# Altium schematic sheet PCA9632_4-Ch_LED_Driver.SchDoc: PCA9632 4-ch LED Driver
size A4
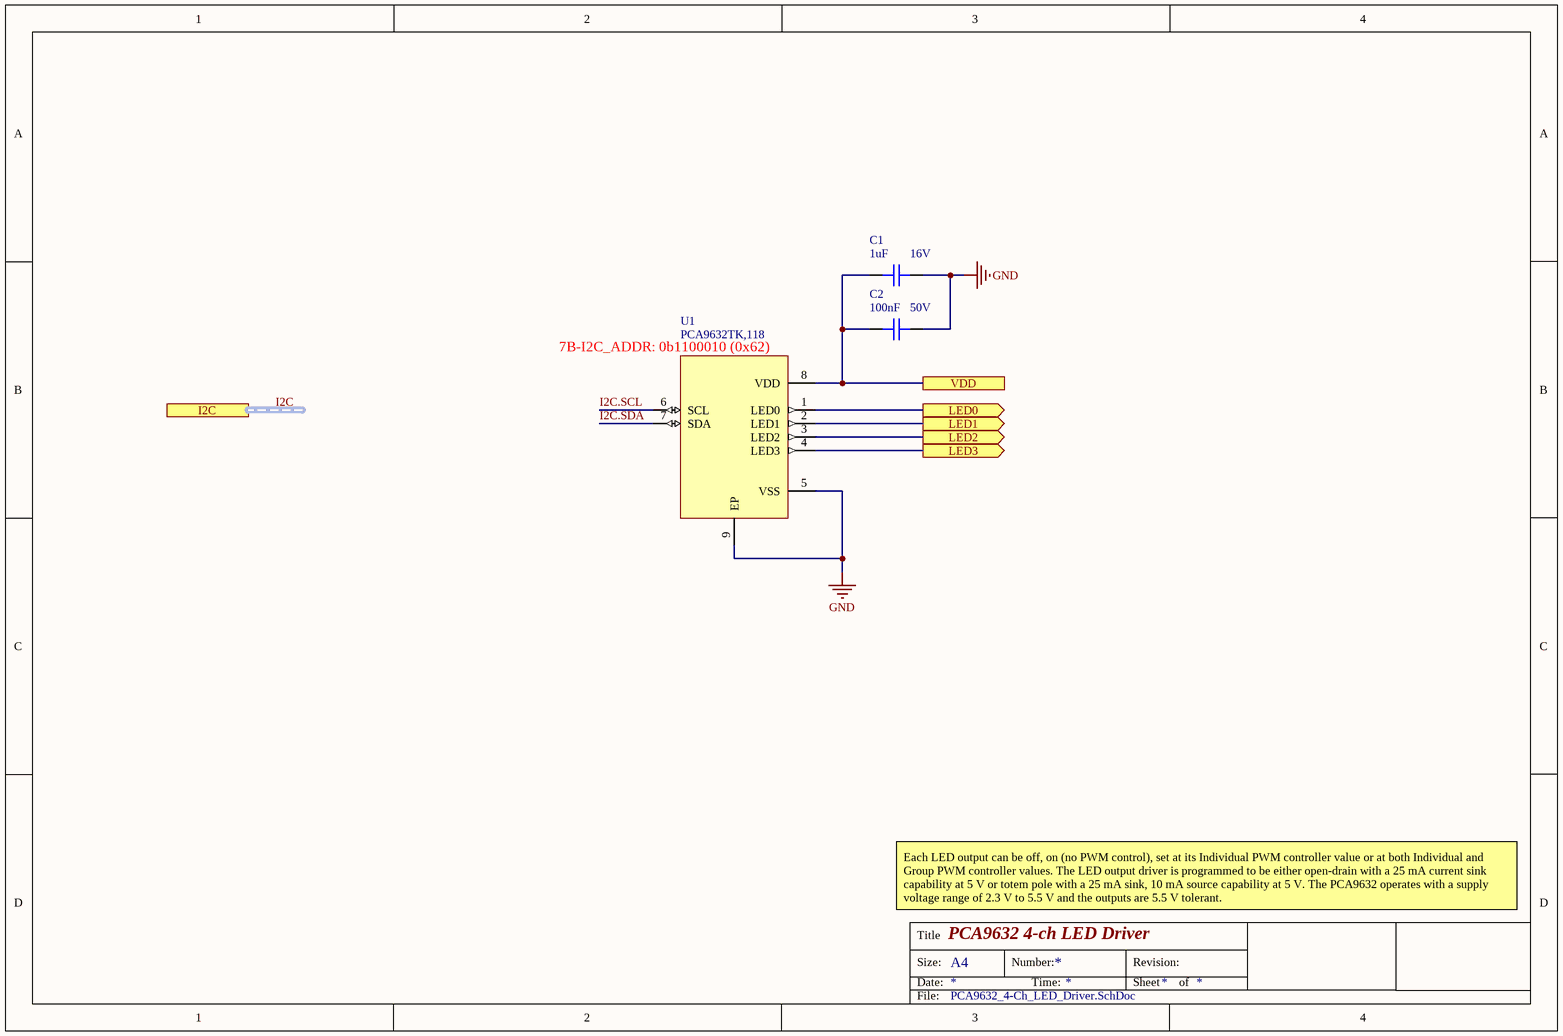
[diagram p0: PCA9632_4-Ch_LED_Driver.SchDoc]

## Parts
C1  Capacitance: 1uF  Voltage Rating: 16V  [C0402]  (hidden comment: CAP CER 1UF 16V X5R 0402)
C2  Capacitance: 100nF  Voltage: 50V  [C0402]  (hidden comment: CAP CER 0.1UF 50V X7R 0402)
U1  PCA9632TK,118  7B-I2C_ADDR: 0b1100010 (0x62)  [SOT908-1]

## Ports
I2C (harness I2C), LED0 (out), LED1 (out), LED2 (out), LED3 (out), VDD

## Nets
GND: C1.1 C2.1 U1.5(VSS) U1.9(EP)
I2C.SCL: U1.6(SCL)
I2C.SDA: U1.7(SDA)
LED0: U1.1(LED0) ; port LED0
LED1: U1.2(LED1) ; port LED1
LED2: U1.3(LED2) ; port LED2
LED3: U1.4(LED3) ; port LED3
VDD: C1.2 C2.2 U1.8(VDD) ; port VDD

## Buses and harness runs
harness I2C = port I2C

## Notes on the sheet
- Each LED output can be off, on (no PWM control), set at its Individual PWM controller value or at both Individual and Group PWM controller values. The LED output driver is programmed to be either open-drain with a 25 mA current sink capability at 5 V or totem pole with a 25 mA sink, 10 mA source capability at 5 V. The PCA9632 operates with a supply voltage range of 2.3 V to 5.5 V and the outputs are 5.5 V tolerant.
- Title
- Size:
- Date:
- A4
- Number:
- Time:
- Revision:
- Sheet
- of
- File:

## Library data of the parts
C1 = CAP CER 1UF 16V X5R 0402: 1µF ±10% 16V Ceramic Capacitor X5R 0402 (1005 Metric); Manufacturer: Yageo; Manufacturer Part Number: CC0402KRX5R7BB105; Supplier 1: Digi-Key; Supplier Part Number 1: 311-1691-1-ND; Stock 1: 1114963; Pricing 1: 1=0.4, 10=0.278, 100=0.167, 500=0.1253, 1000=0.1058, 2500=0.1002, 5000=0.0947 (USD); Mount: Surface Mount; Weight: 2.3E-05oz; Case Code (Imperial): 0402; Case Code (Metric): 1005; Min Operating Temperature: -55°C; Max Operating Temperature: 85°C; Tolerance: 10%; Packaging: Tape and Reel; Voltage Rating (DC): 16V; Dielectric: X5R; Termination: SMD/SMT; Composition: Ceramic; Length: 1mm; Height: 0.5mm; Width: 0.02inch; Depth: 0.5mm; Thickness: 0.022inch; Radiation Hardening: No; Lead Free: Lead Free; Halogen Free: Halogen Free; ComponentLink1URL: http://www.yageo.com/documents/recent/UPY-GPHC_X5R_4V-to-50V_12.pdf?src-supplier=Avnet+Europe; ComponentLink1Description: http://www.yageo.com/documents/recent/UPY-GPHC_X5R_4V-to-50V_12.pdf?src-supplier=Avnet+Europe; Case/Package: 0402
C2 = CAP CER 0.1UF 50V X7R 0402: 0.1µF ±10% 50V Ceramic Capacitor X7R 0402 (1005 Metric); Manufacturer: TDK; Manufacturer Part Number: CGA2B3X7R1H104K050BB; Supplier 1: Digi-Key; Supplier Part Number 1: 445-6899-1-ND; Stock 1: 2925303; Pricing 1: 1=0.17, 10=0.118, 50=0.0668, 100=0.0553, 500=0.0388, 1000=0.0321, 2500=0.0299, 5000=0.0273 (USD); Mount: Surface Mount; Case/Package: 0402; Weight: 2.3E-05oz; Case Code (Metric): 1005; Case Code (Imperial): 0402; Min Operating Temperature: -55°C; Max Operating Temperature: 125°C; Voltage Rating: 50V; Tolerance: 10%; Packaging: Tape and Reel; Package Quantity: 1; Voltage Rating (DC): 50V; Dielectric: X7R; Termination: SMD/SMT; Composition: Ceramic; Length: 1mm; Height: 0.5mm; Width: 0.02inch; Thickness: 0.022inch; Depth: 0.5mm; Ratings: AEC-Q200; REACH SVHC: No SVHC; Lead Free: Lead Free; ComponentLink1URL: http://product.tdk.com/capacitor/mlcc/en/documents/mlccspec_automotive_general_midvoltage_en.pdf?src-supplier=Future+Electronics; ComponentLink1Description: http://product.tdk.com/capacitor/mlcc/en/documents/mlccspec_automotive_general_midvoltage_en.pdf?src-supplier=Future+Electronics; ComponentLink2URL: http://www.farnell.com/datasheets/1807242.pdf?src-supplier=Element14; ComponentLink2Description: http://www.farnell.com/datasheets/1807242.pdf?src-supplier=Element14; ComponentLink3URL: http://www.mouser.com/ds/2/400/lcc_automotive_general_en-843974.pdf?src-supplier=Mouser; ComponentLink3Description: http://www.mouser.com/ds/2/400/lcc_automotive_general_en-843974.pdf?src-supplier=Mouser; ComponentLink4URL: http://www.farnell.com/datasheets/1936565.pdf?src-supplier=Element14; ComponentLink4Description: http://www.farnell.com/datasheets/1936565.pdf?src-supplier=Element14; ComponentLink5URL: http://www.farnell.com/datasheets/1735392.pdf?src-supplier=Element14; ComponentLink5Description: http://www.farnell.com/datasheets/1735392.pdf?src-supplier=Element14
U1 = IC PCA9632TK,118 LED DRVR LIN DIM 25MA 8HVSON: LED Driver IC 4 Output Power Switch  PWM Dimming 25mA 8-HVSON (3x3); Manufacturer: NXP Semiconductors; Max Supply Voltage: 5.5V; Min Supply Voltage: 2.3V; Nominal Supply Current: 150uA; Max Power Dissipation: 400mW; Number of Outputs: 4; Frequency: 400kHz; Max Supply Current: 108uA; Low Level Output Current: 100mA; Supplier 1: Digi-Key; Supplier Part Number 1: 568-8715-1-ND; ComponentLink1Description: http://www.nxp.com/documents/data_sheet/PCA9632.pdf?src-supplier=Digi-Key; ComponentLink1URL: http://www.nxp.com/documents/data_sheet/PCA9632.pdf?src-supplier=Digi-Key; ComponentLink2Description: https://www.nxp.com/docs/en/brochure/75016950.pdf?src-supplier=Digi-Key; ComponentLink2URL: https://www.nxp.com/docs/en/brochure/75016950.pdf?src-supplier=Digi-Key; ComponentLink3Description: http://www.classic.nxp.com/documents/data_sheet/PCA9632.pdf?src-supplier=Avnet+Europe; ComponentLink3URL: http://www.classic.nxp.com/documents/data_sheet/PCA9632.pdf?src-supplier=Avnet+Europe; Manufacturer Part Number: PCA9632TK,118; Stock 1: 2394; Pricing 1: 1=1.33, 10=1.192, 25=1.1312, 100=0.8686, 250=0.7676, 500=0.7272, 1000=0.5656, 2500=0.5373 (USD); Mount: Surface Mount; Number of Pins: 8; Contact Plating: Gold; Min Operating Temperature: -40°C; Max Operating Temperature: 85°C; Packaging: Tape and Reel; Package Quantity: 1; Output Voltage: 5.5V; Power Dissipation: 400mW; Number of Segments: 4; Radiation Hardening: No; Lead Free: Lead Free